# Altium schematic sheet Aex.SchDoc
size A4
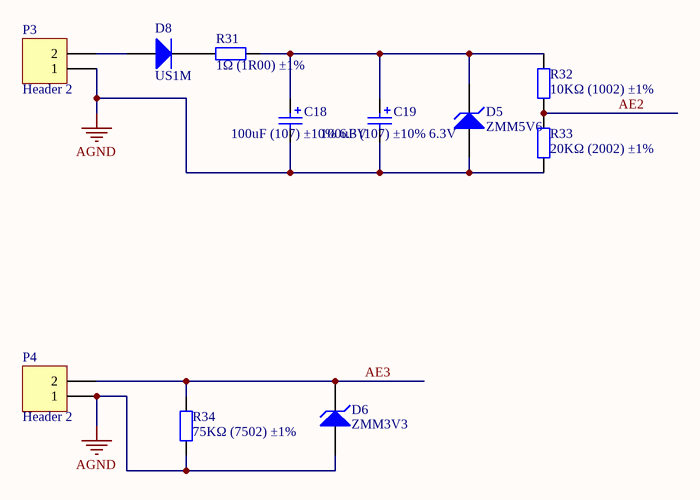
[diagram p0: Aex.SchDoc]

## Parts
C18  100uF (107) ±10% 6.3V  [CASE-B_3528]
C19  100uF (107) ±10% 6.3V  [CASE-B_3528]
D5  ZMM5V6  [LL-34]
D6  ZMM3V3  [LL-34]
D8  US1M  [SMA(DO-214AC)_S1]
P3  Header 2  [HDR1X2]
P4  Header 2  [HDR1X2]
R31  1Ω (1R00) ±1%  [0603_R]
R32  10KΩ (1002) ±1%  [0603_R]
R33  20KΩ (2002) ±1%  [0603_R]
R34  75KΩ (7502) ±1%  [0603_R]

## Nets
AGND: C18.2 C19.2 D5.1(A) D6.1(A) P3.1 P4.1 R33.1 R34.1
AE2: R32.1 R33.2
AE3: D6.2(K) P4.2 R34.2
NetC18_1: C18.1 C19.1 D5.2(K) R31.2 R32.2
NetD8_1: D8.1(A) P3.2
NetD8_2: D8.2(K) R31.1

## Library data of the parts
C18 C19 = 3528 100uF (107) 10% 6.3V: 钽电容; ComponentLink1Description: 供应商链接; ComponentLink1URL: http://www.szlcsc.com/product/details_16815.html; Package: 3528; Supplier: LC; SuppliersPartNumber: C16133
D5 = LL-34 ZMM5V6: 稳压二极管; ComponentLink1Description: 供应商链接; ComponentLink1URL: http://www.szlcsc.com/product/details_8541.html; Package: LL-34; Supplier: LC; SuppliersPartNumber: C8062
D6 = LL-34 ZMM3V3: 稳压二极管; ComponentLink1Description: 供应商链接; ComponentLink1URL: http://www.szlcsc.com/product/details_8535.html; Package: LL-34; Supplier: LC; SuppliersPartNumber: C8056
D8 = SMA(DO-214AC) US1M: 二极管; ComponentLink1Description: 供应商链接; ComponentLink1URL: http://www.szlcsc.com/product/details_5885.html; Package: SMA(DO-214AC); Supplier: LC; SuppliersPartNumber: C5441
P3 P4 = Header 2: Header, 2-Pin; LatestRevisionDate: 17-Jul-2002; LatestRevisionNote: Re-released for DXP Platform.; Publisher: Altium Limited
R31 = 0603 1Ω (1R00) 1%: 贴片电阻; ComponentLink1Description: 供应商链接; ComponentLink1URL: http://www.szlcsc.com/product/details_23663.html; Package: 0603; Supplier: LC; SuppliersPartNumber: C22936
R32 = 0603 10KΩ (1002) 1%: 贴片电阻; ComponentLink1Description: 供应商链接; ComponentLink1URL: http://www.szlcsc.com/product/details_26547.html; Package: 0603; Supplier: LC; SuppliersPartNumber: C25804
R33 = 0603 20KΩ (2002) 1%: 贴片电阻; ComponentLink1Description: 供应商链接; ComponentLink1URL: http://www.szlcsc.com/product/details_4591.html; Package: 0603; Supplier: LC; SuppliersPartNumber: C4184
R34 = 0603 75KΩ (7502) 1%: 贴片电阻; ComponentLink1Description: 供应商链接; ComponentLink1URL: http://www.szlcsc.com/product/details_23969.html; Package: 0603; Supplier: LC; SuppliersPartNumber: C23242